# Altium project Gebru.PrjPcb (part 2 of 2)

## Sheet STO.SchDoc
size 420 x 297 mm; DocumentNumber: 7; SheetNumber: 4; SheetTotal: 6; PageSetup: Record=PageOptions|CenterHorizontal=True|CenterVertical=True|PrintScale=0.96|XCorrection=1.00|YCorrection=1.00|PrintKind=1|BorderSize=5000000|LeftOffset=0|BottomOffset=0|Orientation=2|PaperLength=4318|PaperWidth=2794|Scale=100|PaperSource=7|PrintQuality=600|MediaType=1|DitherType=10|PaperKind=11" x 17"|PrintScaleMode=1
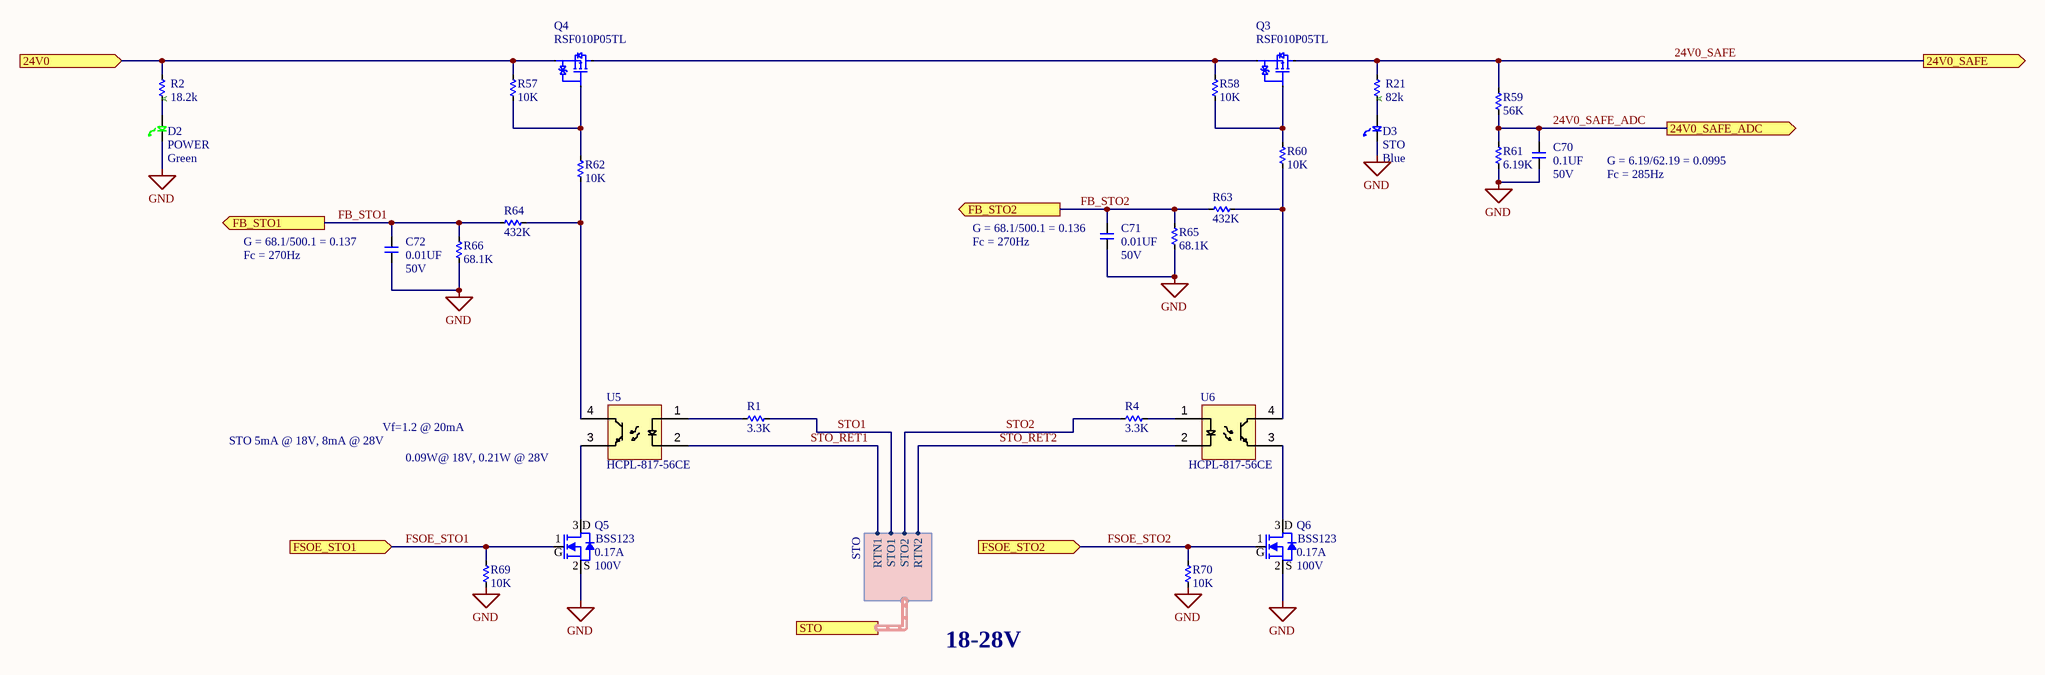
[diagram p4: STO.SchDoc]

### Parts
C70  value 0.1UF  Voltage: 50V  [C0402]  (hidden comment: __Template_Cap)
C71  value 0.01UF  Voltage: 50V  [C0402]  (hidden comment: __Template_Cap)
C72  value 0.01UF  Voltage: 50V  [C0402]  (hidden comment: __Template_Cap)
D2  POWER  value Green  [LEDSC160X80X90L40-GREEN]
D3  STO  value Blue  [LEDSC160X80X90L40-BLUE]
Q3  MFG P/N: RSF010P05TL  [TUMT3]  (hidden comment: PFET_RSF010P05TL)
Q4  MFG P/N: RSF010P05TL  [TUMT3]  (hidden comment: PFET_RSF010P05TL)
Q5  Manufacturer Part Number: BSS123  Current Rating: 0.17A  Voltage Rating: 100V  [SOT23-3P95_240X110L43N]  (hidden comment: ONSEMI BSS123)
Q6  Manufacturer Part Number: BSS123  Current Rating: 0.17A  Voltage Rating: 100V  [SOT23-3P95_240X110L43N]  (hidden comment: ONSEMI BSS123)
R1  value 3.3K  [R1206]
R2  value 18.2k  [RESC100X50X40L25]  (hidden comment: PANASONIC ERJ2RKF1822X)
R4  value 3.3K  [R1206]
R21  value 82k  [RESC100X50X40L25]  (hidden comment: PANASONIC ERJ2RKF8202X)
R57  value 10K  [R0402]
R58  value 10K  [R0402]
R59  value 56K  [R0402]
R60  value 10K  [R0402]
R61  value 6.19K  [R0402]
R62  value 10K  [R0402]
R63  value 432K  [R0402]
R64  value 432K  [R0402]
R65  value 68.1K  [R0402]
R66  value 68.1K  [R0402]
R69  value 10K  [R0402]
R70  value 10K  [R0402]
U5  MFG P/N: HCPL-817-56CE  [OPTO_HCPL-817-56CE]  (hidden comment: OPTO_HCPL-817-56CE)
U6  MFG P/N: HCPL-817-56CE  [OPTO_HCPL-817-56CE]  (hidden comment: OPTO_HCPL-817-56CE)

### Ports
24V0 (in), 24V0_SAFE (out), 24V0_SAFE_ADC (out), FB_STO1 (out), FB_STO2 (out), FSOE_STO1 (in), FSOE_STO2 (in), STO (harness STO)

### Harnesses
STO: RTN1, RTN2, STO1, STO2

### Nets
24V0: Q4.S R2.2 R57.2 ; port 24V0
GND: C70.2 C71.2 C72.2 D2.1(CATHODE) D3.1(CATHODE) Q5.2(S) Q6.2(S) R61.1 R65.1 R66.1 R69.1 R70.1
24V0_SAFE: Q3.D R21.2 R59.2 ; port 24V0_SAFE
24V0_SAFE_ADC: C70.1 R59.1 R61.2 ; port 24V0_SAFE_ADC
FB_STO1: C72.1 R64.1 R66.2 ; port FB_STO1
FB_STO2: C71.1 R63.1 R65.2 ; port FB_STO2
FSOE_STO1: Q5.1(G) R69.2 ; port FSOE_STO1
FSOE_STO2: Q6.1(G) R70.2 ; port FSOE_STO2
STO1: R1.2 ; port STO.STO1
STO2: R4.1 ; port STO.STO2
STO_RET1: U5.2(Cathode) ; port STO.RTN1
STO_RET2: U6.2(Cathode) ; port STO.RTN2
NetD2_2: D2.2(ANODE) R2.1
NetD3_2: D3.2(ANODE) R21.1
NetQ3_G: Q3.G R58.1 R60.2
NetQ3_S: Q3.S Q4.D R58.2
NetQ4_G: Q4.G R57.1 R62.2
NetQ5_3: Q5.3(D) U5.3(Emitter)
NetQ6_3: Q6.3(D) U6.3(Emitter)
NetR1_1: R1.1 U5.1(Anode)
NetR4_2: R4.2 U6.1(Anode)
NetR60_1: R60.1 R63.2 U6.4(Collector)
NetR62_1: R62.1 R64.2 U5.4(Collector)

### Notes on the sheet
- Fc = 285Hz
- G = 6.19/62.19 = 0.0995
- Fc = 270Hz
- (near C72) G = 68.1/500.1 = 0.137
- (near C71) G = 68.1/500.1 = 0.136
- STO 5mA @ 18V, 8mA @ 28V
- Vf=1.2 @ 20mA
- 0.09W@ 18V, 0.21W @ 28V
- 18-28V
- CREATIVE COMMONS
- PUBLIC LICENSE:
- BARKOUR ROBOT
- CC BY-NC 4.0
- APPROVED
- DWG NO
- GOOGLE LLC
- FILE
- RELEASED
- 2024/05/09
- SIZE
- 1600 AMPHITHEATRE PARKWAY
- MOUNTAIN VIEW CA 94043
- A3
- SHEET
- OF
- THIS DESIGN IS BEING PROVIDED  FOR NON-COMMERCIAL USE ONLY. THE USE OF =SCIENTIST_NAME_POSSESSIVE NAME IN CONNECTION WITH THE DESIGN IS NOT INTENDED TO IMPLY THAT =SCIENTIST_NAME SPONSORS OR ENDORSES THE DESIGN, GOOGLE LLC, OR ANY OF GOOGLE LLC'S PRODUCTS OR SERVICES.
- (in symbol 78eec7e5-34dd-5b0c-8bd5-fdbc658ba047) A
- (in symbol 07680e2d-088d-5a06-a7a1-fe9cd6488fb2) A

### Library data of the parts
C70 = 1762: CAP, CER, X5R, 0.1uF, 10%, 50V, 0402, 0.55mm; ID: 1762; MFG: YAGEO; MFG P/N: CC0402KRX5R9BB104; EPIC: G150-02449-00; EES: 150-04581-00; Status: Released; Package: 0402; Dielectric: X5R; Tolerance: 10%; Height: 0.55mm; Supplier 1: Digi-Key; HelpURL: https://www.digikey.com/product-detail/en/yageo/CC0402KRX5R9BB104/311-3342-1-ND/6818312; ComponentLink1Description: Datasheet; ComponentLink1URL: http://www.yageo.com/documents/recent/UPY-GPHC_X5R_4V-to-50V_25.pdf; Supplier Part Number 1: 311-3342-1-ND
C71 C72 = 625: CAP, CER, X7R, 0.01uF, 50V, 20%, 0402, 0.56mm T; ID: 625; MFG: KEMET; MFG P/N: C0402C103M5RACTU; XPN: 150-00227-00; EES: 150-04592-00; Status: Released; Package: 0402; Dielectric: X7R; Tolerance: 20%; Height: 0.56mm T; ComponentLink1Description: Datasheet; COMMON: 150-00227-00; LOON: 150-00227-00; Gecko: 150-00227-00
D2 = 97055cde-46be-5a44-ad2e-f3c9fb2da68b: LED, GREEN, 569nm, 30mA, CLEAR, 0603; Manufacturer: Lite-On Optoelectronics; Manufacturer Part Number: LTST-C190GKT; Part Number: 370-00010-00; Current Rating: 0.030A; Power Rating: 0.100W; ComponentId: 97055cde-46be-5a44-ad2e-f3c9fb2da68b; Package: 0603 (1608 Metric); ComponentLink1Description: Datasheet; ComponentLink1URL: http://media.digikey.com/pdf/Data%20Sheets/Lite-On%20PDFs/LTST-C190GKT.pdf; Category: Light Emitting Diodes (LED); Max Height: 0.90mm; Status: Released; Storage Temperature: -55 °C ~ 85 °C; Operating Temperature: -55 °C ~ 85 °C
D3 = f11939b8-268a-575b-b7c2-77af98891583: LED, BLUE, 470nm, 15mA, DIFFUSED, 0603; Manufacturer: Osram Opto; Manufacturer Part Number: LB Q39G-L2N2-35-1; Part Number: 370-00009-00; Current Rating: 0.015A; Power Rating: 0.048W; ComponentId: f11939b8-268a-575b-b7c2-77af98891583; Package: 0603 (1608 Metric); ComponentLink1Description: Datasheet; ComponentLink1URL: https://media.digikey.com/pdf/Data%20Sheets/Osram%20PDFs/LB_LT%20Q39G.pdf; Category: Light Emitting Diodes (LED); Max Height: 0.40mm; Status: Released; Storage Temperature: -40 °C ~ 85 °C; Operating Temperature: -40 °C ~ 85 °C
Q3 Q4 = 171: MOSFET, PWR, P-CH, 45VDS, 1A ID, 460mOhm@ 1A, SMD-3; ID: 171; MFG: Rohm Semiconductor; FET Type: P-Channel; Voltage - Drain To Source (VDSS): 45V; Current - Continuios Drain (ID) @ 25° C: 1A (Ta); RDS On (Max) @ ID, VGS: 460mOhm @ 1A, 10V; VGS(TH) (Max) @ ID: 2.5V @ 1mA; Gate Charge (QG) @ VGS: 2.3nC @ 5V; Input Capacitance (CISS) @ VDS: 160pF @ 10V; Power - Max: 800mW (Ta); EES: 480-01747-00; Status: Released; Package: TUMT3; Category: MOS-FET; RoHS Compliant: Yes; HelpURL: https://www.digikey.com/product-detail/en/rohm-semiconductor/RSF010P05TL/RSF010P05TLCT-ND/9952105; ComponentLink1Description: Datasheet; ComponentLink1URL: https://d1d2qsbl8m0m72.cloudfront.net/en/products/databook/datasheet/discrete/transistor/mosfet/rsf010p05tl-e.pdf; Operating Temperature: 150°C (TJ); Mounting Type: SM; Supplier 1: Digi-Key; Height: 0.85mm; Supplier Part Number 1: RSF010P05TLCT-ND
Q5 Q6 = ed20cc43-0059-5b34-85f4-540c7b2cf9db: XSTR, MOSFET, ENHANCEMENT MODE, N-CH, 100V, 0.17A, SOT23-3; Manufacturer: ON Semiconductor; Part Number: 480-00042-00; Power Rating: 0.36W; ComponentId: ed20cc43-0059-5b34-85f4-540c7b2cf9db; Package: SOT-23; ComponentLink1Description: Datasheet; ComponentLink1URL: https://www.fairchildsemi.com/datasheets/BS/BSS123.pdf; Category: N-Channel MOSFETs; Max Height: 1.11mm; Status: Released; Storage Temperature: -55 °C ~ 150 °C; Operating Temperature: -55 °C ~ 150 °C
R1 R4 = 3733: Resistor, 3.30K Ohms, 1206, 0.25W, ±1%; ID: 3733; MFG: STACKPOLE ELECTRONICS; MFG P/N: RMCF1206FT3K30; Power: 1/4W; COMMON: 470-07121-00; XPN: XS-10017830; Status: Released; Package: 1206; Tolerance: 1%; Height: 0.70mm; Supplier 1: Digi-Key; Supplier Part Number 1: RMCF1206FT3K30CT-ND
R2 = 78eec7e5-34dd-5b0c-8bd5-fdbc658ba047: Res, 18.2k, +/-1%, 0.1W, 0402, AUTO GRADE; Grade: Automotive; Temperature Coefficient: -100/+100 ppm/degC; Voltage Rating: 50V; ComponentId: 78eec7e5-34dd-5b0c-8bd5-fdbc658ba047; Manufacturer: Panasonic; Manufacturer Part Number: ERJ2RKF1822X; Package: 0402; ComponentLink1Description: Datasheet; ComponentLink1URL: http://industrial.panasonic.com/cdbs/www-data/pdf/RDA0000/AOA0000C304.pdf; Category: Thick Film Resistors; Max Height: 0.40mm; Status: Preliminary; Tolerance: +/-1%; Power Rating: 0.1W; Storage Temperature: -55 °C ~ 155 °C; Operating Temperature: -55 °C ~ 155 °C
R21 = 07680e2d-088d-5a06-a7a1-fe9cd6488fb2: Res, 82k, +/-1%, 0.1W, 0402, AUTO GRADE; Part Number: 470-01975-00; Grade: Automotive; Temperature Coefficient: -100/+100 ppm/degC; Voltage Rating: 50V; ComponentId: 07680e2d-088d-5a06-a7a1-fe9cd6488fb2; Manufacturer: Panasonic; Manufacturer Part Number: ERJ2RKF8202X; Package: 0402; ComponentLink1Description: Datasheet; ComponentLink1URL: http://industrial.panasonic.com/cdbs/www-data/pdf/RDA0000/AOA0000C304.pdf; Category: Thick Film Resistors; Max Height: 0.40mm; Status: Preliminary; Tolerance: +/-1%; Power Rating: 0.1W; Storage Temperature: -55 °C ~ 155 °C; Operating Temperature: -55 °C ~ 155 °C
R57 R58 R60 R62 R69 R70 = 7216: RES, 10K, 1%, 1/10W, 0402, AUTOGRADE; ID: 7216; MFG: PANASONIC; MFG P/N: ERJ2RKF1002X; COMMON: 470-00319-00; Gecko: 470-17736-00; Status: Released; Package: 0402; Power: 1/10W; Tolerance: 1%; XPN: 470-00319-00
R59 = 8099: RES, 56K, 1%, 1/16W, 0402; ID: 8099; MFG: VISHAY; MFG P/N: CRCW040256K0FKED; COMMON: 470-02723-00; PROXY: 470-16033-00; XPN: XS-10013985; Status: Released; Package: 0402; Power: 1/16W; Tolerance: 1%
R61 = 9146: RES, 6.19K, 1%, 1/16W, 0402; ID: 9146; MFG: Yageo; MFG P/N: RC0402FR-076K19L; PROXY: 470-16530-00; Status: Released; Package: 0402; Power: 1/16W; Tolerance: 1%; Height: 0.40mm; Supplier 1: Digi-Key; HelpURL: https://www.digikey.in/product-detail/en/yageo/RC0402FR-076K19L/311-6.19KLRCT-ND/2827950; ComponentLink1Description: Datasheet; ComponentLink1URL: http://www.yageo.com/documents/recent/PYu-RC_Group_51_RoHS_L_10.pdf; Supplier Part Number 1: 311-6.19KLRCT-ND
R63 R64 = 8801: RES, 432K, 1%, 1/16W, 0402; ID: 8801; MFG: VISHAY; MFG P/N: CRCW0402432KFKED; PROXY: Use ID #9276; Status: Released; Package: 0402; Power: 1/16W; Tolerance: 1%; Height: 0.45mm; Supplier 1: Digi-Key; HelpURL: https://www.digikey.com/products/en?keywords=CRCW0402432KFKED; ComponentLink1Description: Datasheet; ComponentLink1URL: http://www.vishay.com/docs/28773/crcwce3.pdf
R65 R66 = 4849: RES, 68.1K, 1%, 1/16W, 0402; ID: 4849; MFG: VISHAY; MFG P/N: CRCW040268K1FKED; COMMON: 470-03513-00; PROXY: Use ID #9218; Status: Released; Package: 0402; Power: 1/16W; Tolerance: 1%; Height: 0.40mm; Supplier 1: Digi-Key; XPN: 470-03513-00; Supplier Part Number 1: 541-68.1KLCT-ND
U5 U6 = 276: ISOLATOR, OPTOISOLATOR, PHOTO TRANSISTOR, 70V, 50mA, SMD-4; ID: 276; MFG: Broadcom Limited; EES: 370-00610-00; Status: Released; Package: 4-SMD; Category: Integrated Circuits (ICs); RoHS Compliant: Yes; Supplier 1: Digi-Key; HelpURL: https://www.digikey.com/product-detail/en/broadcom-limited/HCPL-817-56CE/516-3136-1-ND/4969477; ComponentLink1Description: Datasheet; ComponentLink1URL: https://docs.broadcom.com/doc/AV02-0265EN; Mounting Type: SMD; Height: 4.6mm; Supplier Part Number 1: 516-3136-1-ND

## Sheet MezzanineConnectors.SchDoc
size 420 x 297 mm; DocumentNumber: 6; SheetNumber: 5; SheetTotal: 6; PageSetup: Record=PageOptions|CenterHorizontal=True|CenterVertical=True|PrintScale=0.96|XCorrection=1.00|YCorrection=1.00|PrintKind=1|BorderSize=5000000|LeftOffset=0|BottomOffset=0|Orientation=2|PaperLength=4318|PaperWidth=2794|Scale=100|PaperSource=7|PrintQuality=600|MediaType=1|DitherType=10|PaperKind=11" x 17"|PrintScaleMode=1
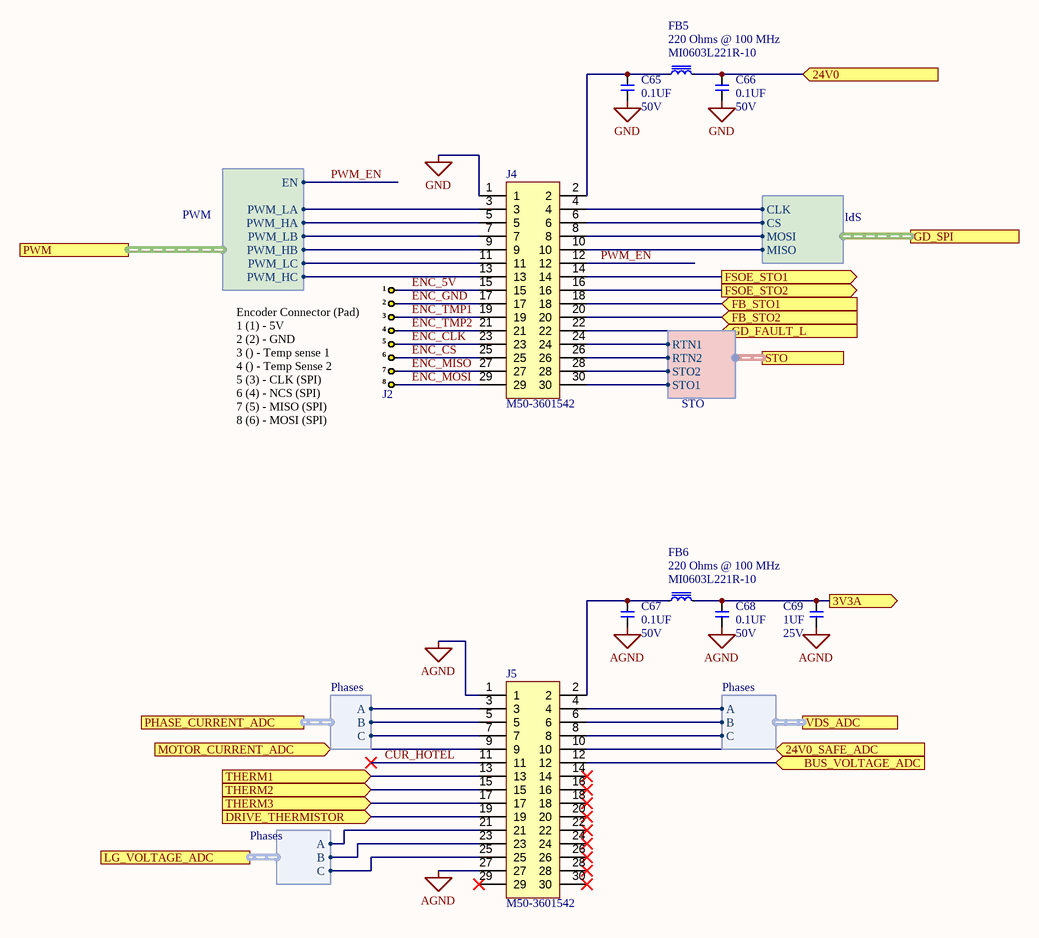
[diagram p5: MezzanineConnectors.SchDoc]

### Parts
C65  value 0.1UF  Voltage: 50V  [C0402]  (hidden comment: __Template_Cap)
C66  value 0.1UF  Voltage: 50V  [C0402]  (hidden comment: __Template_Cap)
C67  value 0.1UF  Voltage: 50V  [C0402]  (hidden comment: __Template_Cap)
C68  value 0.1UF  Voltage: 50V  [C0402]  (hidden comment: __Template_Cap)
C69  value 1UF  Voltage: 25V  [C0402]  (hidden comment: __Template_Cap)
FB5  value 220 Ohms @ 100 MHz  Manufacturer Part Number: MI0603L221R-10  [INDC160X80X105L30N]  (hidden comment: LAIRD MI0603L221R-10)
FB6  value 220 Ohms @ 100 MHz  Manufacturer Part Number: MI0603L221R-10  [INDC160X80X105L30N]  (hidden comment: LAIRD MI0603L221R-10)
J2  DIRECT_SOLDER_8_PIN  [8_PIN_DIRECT_25mil_1.5mm]  (value not drawn)  (no BOM)
J4  MFG P/N: M50-3601542  [HARWIN_M50-3601542]
J5  MFG P/N: M50-3601542  [HARWIN_M50-3601542]

### Ports
3V3A (out), 24V0 (in), 24V0_SAFE_ADC (in), BUS_VOLTAGE_ADC (in), DRIVE_THERMISTOR (in), FB_STO1 (in), FB_STO2 (in), FSOE_STO1 (out), FSOE_STO2 (out), GD_FAULT_L (in), GD_SPI (harness SPI), LG_VOLTAGE_ADC (harness Phases), MOTOR_CURRENT_ADC (in), PHASE_CURRENT_ADC (harness Phases), PWM (harness PWM), STO (harness STO), THERM1 (in), THERM2 (in), THERM3 (in), VDS_ADC (harness Phases)

### Harnesses
PWM: EN, PWM_HA, PWM_LA, PWM_HB, PWM_LB, PWM_HC, PWM_LC
SPI: CLK, CS, MOSI, MISO
Phases: A, B, C
STO: RTN1, RTN2, STO1, STO2

### Nets
3V3A: C68.1 C69.1 FB6.2 ; port 3V3A
24V0: C66.1 FB5.2 ; port 24V0
AGND: C67.2 C68.2 C69.2 J5.1 J5.27
GND: C65.2 C66.2 J4.1
24V0_SAFE_ADC: J5.10 ; port 24V0_SAFE_ADC
CUR_HOTEL: J5.11
ENC_5V: J2.1 J4.15
ENC_CLK: J2.5 J4.23
ENC_CS: J2.6 J4.25
ENC_GND: J2.2 J4.17
ENC_MISO: J2.7 J4.27
ENC_MOSI: J2.8 J4.29
ENC_TMP1: J2.3 J4.19
ENC_TMP2: J2.4 J4.21
FB_STO1: J4.18 ; port FB_STO1
FB_STO2: J4.20 ; port FB_STO2
FSOE_STO1: J4.14 ; port FSOE_STO1
FSOE_STO2: J4.16 ; port FSOE_STO2
GD_CLK: J4.4 ; port GD_SPI.CLK
GD_CS: J4.6 ; port GD_SPI.CS
GD_FAULT_L: J4.22 ; port GD_FAULT_L
GD_MISO: J4.10 ; port GD_SPI.MISO
GD_MOSI: J4.8 ; port GD_SPI.MOSI
MOTOR_CURRENT_ADC: J5.9 ; port MOTOR_CURRENT_ADC
PHASE_I_ADC_A: J5.3 ; port PHASE_CURRENT_ADC.A
PHASE_I_ADC_B: J5.5 ; port PHASE_CURRENT_ADC.B
PHASE_I_ADC_C: J5.7 ; port PHASE_CURRENT_ADC.C
PHASE_V_ADC_A: J5.21 ; port LG_VOLTAGE_ADC.A
PHASE_V_ADC_B: J5.23 ; port LG_VOLTAGE_ADC.B
PHASE_V_ADC_C: J5.25 ; port LG_VOLTAGE_ADC.C
PWM_EN: J4.12 ; port PWM.EN
PWM_HA: J4.5 ; port PWM.PWM_HA
PWM_HB: J4.9 ; port PWM.PWM_HB
PWM_HC: J4.13 ; port PWM.PWM_HC
PWM_LA: J4.3 ; port PWM.PWM_LA
PWM_LB: J4.7 ; port PWM.PWM_LB
PWM_LC: J4.11 ; port PWM.PWM_LC
STO1: J4.30 ; port STO.STO1
STO2: J4.28 ; port STO.STO2
STO_RET1: J4.24 ; port STO.RTN1
STO_RET2: J4.26 ; port STO.RTN2
VDS_A_ADC: J5.8 ; port VDS_ADC.C
VDS_B_ADC: J5.6 ; port VDS_ADC.B
VDS_C_ADC: J5.4 ; port VDS_ADC.A
NetC52_1: J5.12 ; port BUS_VOLTAGE_ADC
NetC65_1: C65.1 FB5.1 J4.2
NetC67_1: C67.1 FB6.1 J5.2
NetFB2_2: J5.13 ; port THERM1
NetFB3_2: J5.15 ; port THERM2
NetFB4_2: J5.17 ; port THERM3
NetJ5_19: J5.19 ; port DRIVE_THERMISTOR

Not connected (* = marked no-connect by the designer): J5 14* 16* 18* 20* 22* 24* 26* 28* 29* 30*

### Notes on the sheet
- (near J2) Encoder Connector (Pad)
  1 (1) - 5V
  2 (2) - GND
  3 () - Temp sense 1
  4 () - Temp Sense 2
  5 (3) - CLK (SPI)
  6 (4) - NCS (SPI)
  7 (5) - MISO (SPI)
  8 (6) - MOSI (SPI)
- CREATIVE COMMONS
- PUBLIC LICENSE:
- BARKOUR ROBOT
- CC BY-NC 4.0
- APPROVED
- DWG NO
- GOOGLE LLC
- FILE
- RELEASED
- 2024/05/09
- SIZE
- 1600 AMPHITHEATRE PARKWAY
- MOUNTAIN VIEW CA 94043
- A3
- SHEET
- OF
- THIS DESIGN IS BEING PROVIDED  FOR NON-COMMERCIAL USE ONLY. THE USE OF =SCIENTIST_NAME_POSSESSIVE NAME IN CONNECTION WITH THE DESIGN IS NOT INTENDED TO IMPLY THAT =SCIENTIST_NAME SPONSORS OR ENDORSES THE DESIGN, GOOGLE LLC, OR ANY OF GOOGLE LLC'S PRODUCTS OR SERVICES.

### Library data of the parts
C65-C68 = 1762: as C70 on sheet STO; Status: Released; Package: 0402; Dielectric: X5R; Tolerance: 10%; Height: 0.55mm; Supplier 1: Digi-Key; HelpURL: https://www.digikey.com/product-detail/en/yageo/CC0402KRX5R9BB104/311-3342-1-ND/6818312; ComponentLink1Description: Datasheet; ComponentLink1URL: http://www.yageo.com/documents/recent/UPY-GPHC_X5R_4V-to-50V_25.pdf; Supplier Part Number 1: 311-3342-1-ND
C69 = 1717: CAP, CER, X5R, 1uF, 10%, 25V, 0402; ID: 1717; MFG: TDK; MFG P/N: C1005X5R1E105K050BC; COMMON: 150-01202-00; PROXY: 150-03358-00; EES: 150-04580-00; Status: Released; Package: 0402; Dielectric: X5R; Tolerance: 10%; Height: 0.56mm; Supplier 1: Digi-Key; HelpURL: https://www.digikey.in/product-detail/en/tdk-corporation/C1005X5R1E105K050BC/445-9066-1-ND/3648637; ComponentLink1Description: Datasheet; ComponentLink1URL: https://product.tdk.com/info/en/catalog/datasheets/mlcc_commercial_general_en.pdf; Supplier Part Number 1: 445-9066-1-ND
FB5 FB6 = f5bd4cf1-070f-4480-bf1a-f8cba0e78574: FERRITE BEAD 220 OHM 0603 1LN; Manufacturer: Laird Technologies; Grade: Commercial; Current Rating: 2A; ComponentId: f5bd4cf1-070f-4480-bf1a-f8cba0e78574; Package: Inductor, 0603; ComponentLink1Description: Datasheet; ComponentLink1URL: https://media.digikey.com/pdf/Data%20Sheets/Laird%20Technologies/EMI_Filtering_and_RF_Inductors.pdf; Category: Ferrite Beads; Status: Preliminary; Storage Temperature: -40 °C ~ 125 °C; Operating Temperature: -40 °C ~ 125 °C
J4 J5 = 1207: CONN, HDR, UNSHRD, VERT, 2x15 P, 1.27MM PITCH, 5.33MM H, GOLD, SMD; ID: 1207; MFG: Harwin Inc.; Connector Type: Header; Number of Positions: 30; Gender: Male; Current Rating: 1A; EES: 210-04985-00; Sub Assy Qty 2: 0; Status: Released; RoHS Compliant: Yes; Mounting Type: Surface Mount; Orientation: Vertical; Pitch: 1.27mm; Number of Rows: 2; Row Spacing: 1.27mm; Operating Temperature: -40°C ~ 105°C; Supplier 1: Digi-Key; HelpURL: https://www.digikey.com/en/products/detail/harwin-inc/M50-3601542/2762094; ComponentLink1Description: Datasheet; ComponentLink1URL: https://cdn.harwin.com/pdfs/M50-360.pdf; Height: 5.33mm; Supplier Part Number 1: 952-1695-ND; Sub Assy Qty 3: 0; Sub Assy Qty 4: 0

## Nets that join several sheets
3V3A: Feedback (11 pins), Drive (5 pins), MezzanineConnectors (C68.1 C69.1 FB6.2)
24V0: Drive (C31.1 C32.1 C33.1 R17.2), STO (Q4.S R2.2 R57.2), MezzanineConnectors (C66.1 FB5.2)
AGND: 1-Top (6 pins), Feedback (22 pins), Drive (10 pins), MezzanineConnectors (5 pins)
GND: 1-Top (13 pins), Feedback (12 pins), Drive (27 pins), driver/PHA (5 pins), driver/PHB (5 pins), driver/PHC (5 pins), STO (12 pins), MezzanineConnectors (C65.2 C66.2 J4.1)
MPWR: Feedback (R37.1), Drive (11 pins), driver/PHA (C62A.1 C63A.1 Q1A.5 R24A.2), driver/PHB (C62B.1 C63B.1 Q1B.5 R24B.2), driver/PHC (C62C.1 C63C.1 Q1C.5 R24C.2)
MPWR_IN: 1-Top (C3.1 C4.1 D1.K M9.1), Drive (7 pins)
24V0_SAFE: Drive (C16.1 C17.1 U11.5), STO (Q3.D R21.2 R59.2)
24V0_SAFE_ADC: STO (C70.1 R59.1 R61.2), MezzanineConnectors (J5.10)
FB_STO1: STO (C72.1 R64.1 R66.2), MezzanineConnectors (J4.18)
FB_STO2: STO (C71.1 R63.1 R65.2), MezzanineConnectors (J4.20)
FSOE_STO1: STO (Q5.1 R69.2), MezzanineConnectors (J4.14)
FSOE_STO2: STO (Q6.1 R70.2), MezzanineConnectors (J4.16)
GD_CLK: Drive (U11.31), MezzanineConnectors (J4.4)
GD_CS: Drive (U11.32), MezzanineConnectors (J4.6)
GD_FAULT_L: Drive (U11.28), MezzanineConnectors (J4.22)
GD_MISO: Drive (U11.29), MezzanineConnectors (J4.10)
GD_MOSI: Drive (U11.30), MezzanineConnectors (J4.8)
GHA: Drive (U11.8), driver/PHA (Q1A.4)
GHB: Drive (U11.17), driver/PHB (Q1B.4)
GHC: Drive (U11.18), driver/PHC (Q1C.4)
GLA: Drive (U11.10), driver/PHA (Q2A.4)
GLB: Drive (U11.15), driver/PHB (Q2B.4)
GLC: Drive (U11.20), driver/PHC (Q2C.4)
MOTOR_CURRENT_ADC: Drive (C24.1 R11.2 TP10.1), MezzanineConnectors (J5.9)
NetC52_1: Feedback (C52.1 R36.2 TP7.1), MezzanineConnectors (J5.12)
NetFB2_2: 1-Top (FB2.2), MezzanineConnectors (J5.13)
NetFB3_2: 1-Top (FB3.2), MezzanineConnectors (J5.15)
NetFB4_2: 1-Top (FB4.2), MezzanineConnectors (J5.17)
NetJ5_19: Drive (R23.1), MezzanineConnectors (J5.19)
PHASE_I_ADC_A: Feedback (C41.1 R9.2 TP3.1), MezzanineConnectors (J5.3)
PHASE_I_ADC_B: Feedback (C42.1 R5.2 TP4.1), MezzanineConnectors (J5.5)
PHASE_I_ADC_C: Feedback (C43.1 R25.2 TP5.1), MezzanineConnectors (J5.7)
PHASE_V_ADC_A: Feedback (C59.1 R50.2 TP9.1), MezzanineConnectors (J5.21)
PHASE_V_ADC_B: Feedback (C55.1 R43.2 TP8.1), MezzanineConnectors (J5.23)
PHASE_V_ADC_C: Feedback (C47.1 R29.2 TP6.1), MezzanineConnectors (J5.25)
PHASEA: Feedback (R6.1 R51.1 U1.8), Drive (U11.9), driver/PHA (C1A.1 Q1A.1 Q2A.5 R54A.2)
PHASEA_OUT: 1-Top (M1.1), Feedback (R6.2 U1.1)
PHASEB: Feedback (R7.1 R44.1 U2.8), Drive (U11.16), driver/PHB (C1B.1 Q1B.1 Q2B.5 R54B.2)
PHASEB_OUT: 1-Top (M2.1), Feedback (R7.2 U2.1)
PHASEC: Feedback (R8.1 R30.1 U3.8), Drive (U11.19), driver/PHC (C1C.1 Q1C.1 Q2C.5 R54C.2)
PHASEC_OUT: 1-Top (M3.1), Feedback (R8.2 U3.1)
PWM_EN: Drive (U11.33), MezzanineConnectors (J4.12)
PWM_HA: Drive (U11.34), MezzanineConnectors (J4.5)
PWM_HB: Drive (U11.36), MezzanineConnectors (J4.9)
PWM_HC: Drive (U11.38), MezzanineConnectors (J4.13)
PWM_LA: Drive (U11.35), MezzanineConnectors (J4.3)
PWM_LB: Drive (U11.37), MezzanineConnectors (J4.7)
PWM_LC: Drive (U11.39), MezzanineConnectors (J4.11)
SNA: Drive (U11.12), driver/PHA (NT1A.1)
SNB: Drive (U11.13), driver/PHB (NT1B.1)
SNC: Drive (U11.22), driver/PHC (NT1C.1)
STO1: STO (R1.2), MezzanineConnectors (J4.30)
STO2: STO (R4.1), MezzanineConnectors (J4.28)
STO_RET1: STO (U5.2), MezzanineConnectors (J4.24)
STO_RET2: STO (U6.2), MezzanineConnectors (J4.26)
VDS_A_ADC: Drive (C27.1 R15.1), MezzanineConnectors (J5.8)
VDS_B_ADC: Drive (C28.1 R14.1), MezzanineConnectors (J5.6)
VDS_C_ADC: Drive (C29.1 R13.1), MezzanineConnectors (J5.4)

## Assembly variants
PCBA: not fitted C64A C64B C64C M4 M5 M6 M7 Mic1 R54A R54B R54C R73